# EAGLE design amiga_ps2_adapter (EAGLE 9.6.1)
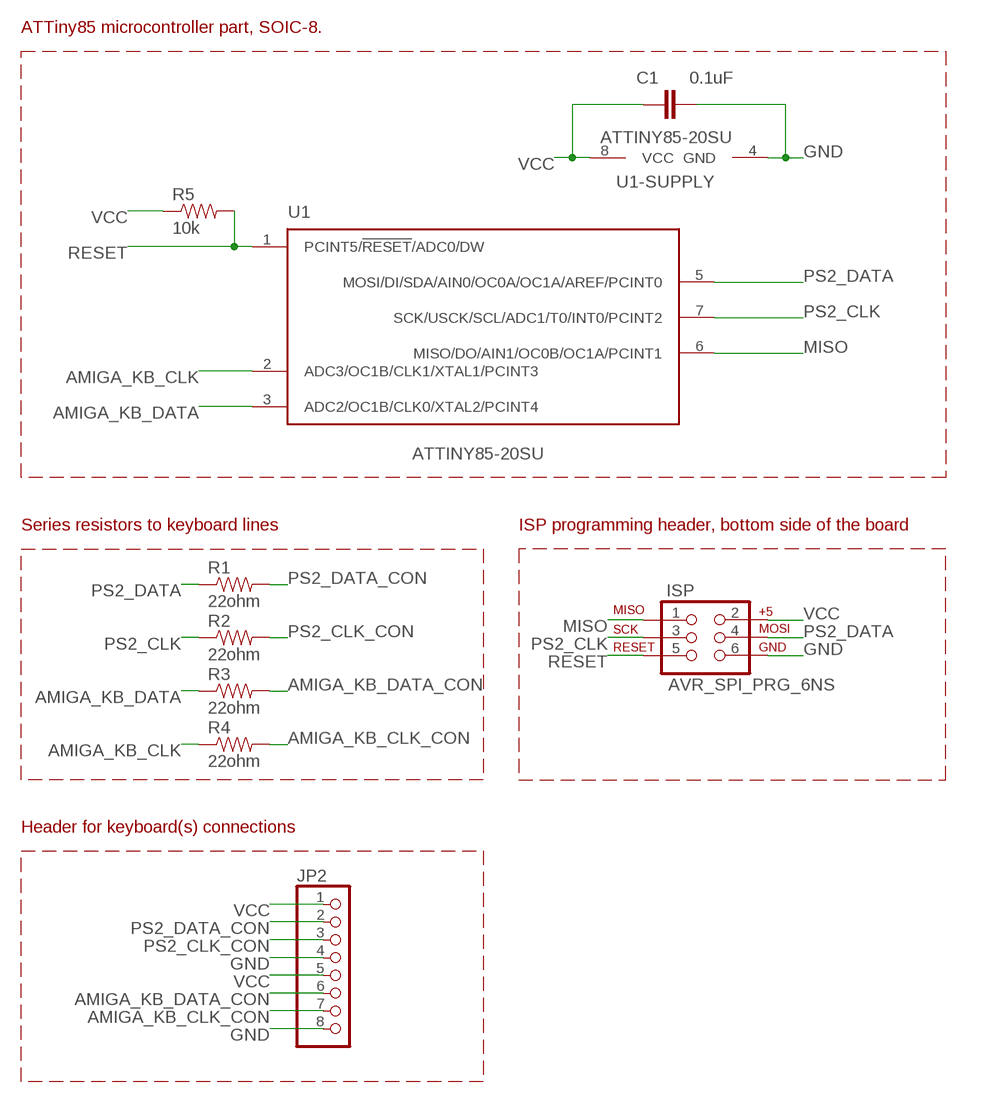
[diagram p0: schematic, sheet 1]

## Parts
C1  0.1uF  CAP0603-CAP  [0603-CAP]
ISP  AVR_SPI_PRG_6NS  [2X3-NS]
JP2  HEADER-1X8ROUND  [1X08_ROUND]
R1  22ohm  RESISTOR0603-RES  [0603-RES]
R2  22ohm  RESISTOR0603-RES  [0603-RES]
R3  22ohm  RESISTOR0603-RES  [0603-RES]
R4  22ohm  RESISTOR0603-RES  [0603-RES]
R5  10k  RESISTOR0603-RES  [0603-RES]
U1  ATTINY85-20SU  [SOIC-8]

## Nets
AMIGA_KB_CLK: R4.1 U1.2(ADC3/OC1B/CLK1/XTAL1/PCINT3)
AMIGA_KB_CLK_CON: JP2.7 R4.2
AMIGA_KB_DATA: R3.1 U1.3(ADC2/OC1B/CLK0/XTAL2/PCINT4)
AMIGA_KB_DATA_CON: JP2.6 R3.2
GND: C1.2 ISP.6 JP2.4 JP2.8 U1.4(GND)
MISO: ISP.1 U1.6(MISO/DO/AIN1/OC0B/OC1A/PCINT1)
PS2_CLK: ISP.3 R2.1 U1.7(SCK/USCK/SCL/ADC1/T0/INT0/PCINT2)
PS2_CLK_CON: JP2.3 R2.2
PS2_DATA: ISP.4 R1.1 U1.5(MOSI/DI/SDA/AIN0/OC0A/OC1A/AREF/PCINT0)
PS2_DATA_CON: JP2.2 R1.2
RESET: ISP.5 R5.2 U1.1(PCINT5/!RESET!/ADC0/DW)
VCC: C1.1 ISP.2 JP2.1 JP2.5 R5.1 U1.8(VCC)

## Notes on the sheet
- ATTiny85 microcontroller part, SOIC-8.
- Series resistors to keyboard lines | ISP programming header, bottom side of the board
- Header for keyboard(s) connections

## Library data of the parts
C1 = SparkFun-Capacitors:CAP: Capacitor Standard 0603 ceramic capacitor, and 0.1" leaded capacitor.
ISP = SparkFun-Connectors:AVR_SPI_PRG_6: AVR ISP 6 Pin This is the reduced ISP connector for AVR programming. Common on Arduino. This footprint will take up less PCB space and can be used with a 10-pin to 6-pin adapter such as SKU: BOB-08508 **Special note about "TEST_POINT" package. The stop mask is on the top side, so if you want your programming test points to be on the bottom of your board, make sure to place this package on the bottom side of the board. This also ensure that the orientation to program from the bottom side will be correct.
JP2 = microbuilder:HEADER-1X8: PIN HEADER
R1-R5 = SparkFun-Passives:RESISTOR: Resistor Basic schematic elements and footprints for 0603, 1206, and PTH resistors.
U1 = volks73-Atmel:ATTINY*5-?: AVR® ATtiny2/4/85 Microcontroller Atmel 8-bit AVR Microcontroller with 2/4/8K Bytes In-System Programmable Flash Documentation Datasheet <http://www.atmel.com/images/atmel-2586-avr-8-bit-microcontroller-attiny25-attiny45-attiny85_datasheet.pdf> Features High Performance, Low Power AVR® 8-Bit Microcontroller Advanced RISC Architecture 120 Powerful Instructions – Most Single Clock Cycle Execution 32 x 8 General Purpose Working Registers Fully Static Operation Non-volatile Program and Data Memories 2/4/8K Bytes of In-System Programmable Program Memory Flash Endurance: 10,000 Write/Erase Cycles 128/256/512 Bytes In-System Programmable EEPROM Endurance: 100,000 Write/Erase Cycles 128/256/512 Bytes Internal SRAM Programming Lock for Self-Programming Flash Program and EEPROM Data Security Peripheral Features 8-bit Timer/Counter with Prescaler and Two PWM Channels 8-bit High Speed Timer/Counter with Separate Prescaler 2 High Frequency PWM Outputs with Separate Output Compare Registers Programmable Dead Time Generator USI – Universal Serial Interface with Start Condition Detector 10-bit ADC 4 Single Ended Channels 2 Differential ADC Channel Pairs with Programmable Gain (1x, 20x) Temperature Measurement Programmable Watchdog Timer with Separate On-chip Oscillator On-chip Analog Comparator Special Microcontroller Features debugWIRE On-chip Debug System In-System Programmable via SPI Port External and Internal Interrupt Sources Low Power Idle, ADC Noise Reduction, and Power-down Modes Enhanced Power-on Reset Circuit Programmable Brown-out Detection Circuit Internal Calibrated Oscillator I/O and Packages Six Programmable I/O Lines 8-pin PDIP, 8-pin SOIC, 20-pad QFN/MLF, and 8-pin TSSOP (only ATtiny45/V) Operating Voltage 1.8 - 5.5V for ATtiny25V/45V/85V 2.7 - 5.5V for ATtiny25/45/85 Speed Grade ATtiny25V/45V/85V: 0 – 4 MHz @ 1.8 - 5.5V, 0 - 10 MHz @ 2.7 - 5.5V ATtiny25/45/85: 0 – 10 MHz @ 2.7 - 5.5V, 0 - 20 MHz @ 4.5 - 5.5V Industrial Temperature Range Low Power Consumption Active Mode: 1 MHz, 1.8V: 300 μA Power-down Mode: 0.1 μA at 1.8V; CATEGORY: Integrated Circuits (ICs); CONNECTIVITY: USI; CORE_PROCESSOR: AVR; CORE_SIZE: 8-Bit; DATA_CONVERTERS: A/D 4x10b; DESCRIPTION: IC MCU 8BIT 8KB FLASH 8SOIC; DOCUMENTATION_LINK: <a href="http://www.atmel.com/Images/Atmel-2586-AVR-8-bit-Microcontroller-ATtiny25-ATtiny45-ATtiny85_Datasheet.pdf">Datasheet</a>; DOCUMENTATION_URL: http://www.atmel.com/Images/Atmel-2586-AVR-8-bit-Microcontroller-ATtiny25-ATtiny45-ATtiny85_Datasheet.pdf; EEPROM_SIZE: 512 x 8; FAMILY: Embedded - Microcontrollers; MANUFACTURER: Atmel; NUMBER_OF_IO: 6; OPERATING_TEMPERATURE: -40°C ~ 85°C; OSCILLATOR_TYPE: Internal; PACKAGE: 8-SOIC (0.209", 5.30mm Width); PART_NUMBER: ATTINY85-20SU; PERIPHERALS: Brown-out Detect/Reset, POR, PWM, WDT; PROGRAM_MEMORY_SIZE: 8KB (4K x 16); PROGRAM_MEMORY_TYPE: FLASH; RAM_SIZE: 512 x 8; SERIES: AVR® ATtiny; SPEED: 20MHz; SUPPLIER_DEVICE_PACKAGE: 8-SOIC; SUPPLIER_ITEM_LINK: <a href="http://www.digikey.com/product-detail/en/ATTINY85-20SU/ATTINY85-20SU-ND/735470">Details</a>; SUPPLIER_ITEM_NUMBER: ATTINY85-20SU-ND; SUPPLIER_ITEM_URL: http://www.digikey.com/product-detail/en/ATTINY85-20SU/ATTINY85-20SU-ND/735470; SUPPLIER_LINK: <a href="http://www.digikey.com">Home Page</a>; SUPPLIER_NAME: Digi-Key; SUPPLIER_URL: http://www.digikey.com; VOLTAGE-SUPPLY: 2.7 V ~ 5.5 V

## Board
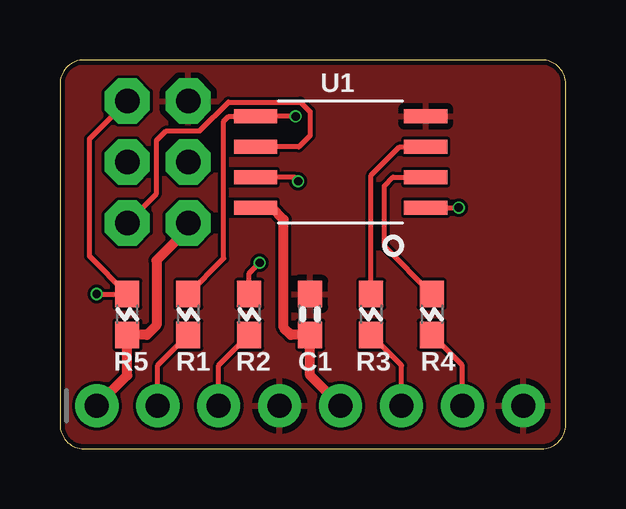
[diagram p1: board, top side]
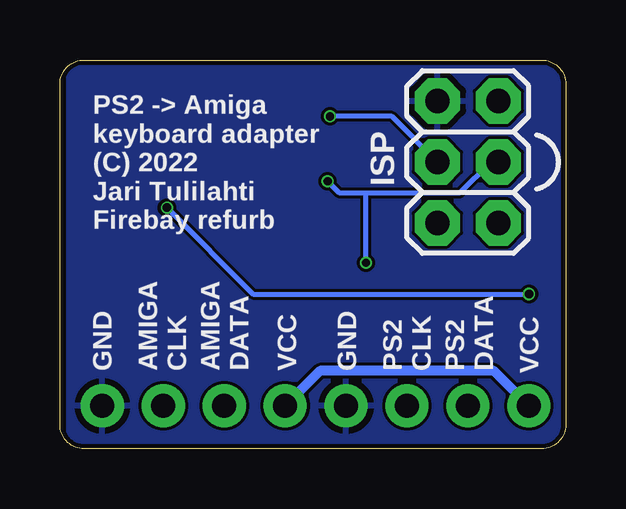
[diagram p2: board, bottom side, seen from below]

Size 21.09 x 16.2 mm. Coordinates in mm from the lower left corner, seen from the top.
Outline: 0,15.2 0,1 arc90 1,0 20.09,0 arc90 21.09,1 21.09,15.2 arc90 20.09,16.2 1,16.2 arc90 0,15.2
Copper layers (1*16): Top 0.035mm / dielectric 1.6mm / Bottom 0.035mm
Design rules "jlcpcb-2layers": minimum track width 5mil, minimum drill 0.3mm, track to track 5mil, track to pad 5mil, pad to pad 5mil, via to via 5mil, smd to smd 5mil, copper to edge 0.2mm, drill to drill 6mil, minimum pad ring 10mil, minimum via ring 3mil, stop-mask expansion 4mil, vias tented up to drill 0mil, thermal gap 10mil

### Footprints (pad centres in the part's own frame; a part is rotated, then mirrored left to right if it is on the bottom)
0603-CAP = smd 1.1 x 1: 1 -0.85,0; 2 0.85,0
2X3-NS = drill 1.016 pad 1.88 octagon: 1 -2.54,-1.27; 2 -2.54,1.27; 3 0,-1.27; 4 0,1.27; 5 2.54,-1.27; 6 2.54,1.27
1X08_ROUND = drill 1 pad 1.676: 1 -8.89,0; 2 -6.35,0; 3 -3.81,0; 4 -1.27,0; 5 1.27,0; 6 3.81,0; 7 6.35,0; 8 8.89,0
0603-RES = smd 1.1 x 1: 1 -0.85,0; 2 0.85,0
SOIC-8 = smd 1.8 x 0.6: 1 -3.55,1.905; 2 -3.55,0.635; 3 -3.55,-0.635; 4 -3.55,-1.905; 5 3.55,-1.905; 6 3.55,-0.635; 7 3.55,0.635; 8 3.55,1.905

### Placement (x,y rotation side)
C1  10.43,5.6 90 top
ISP  4.08,11.95 90 bottom
JP2  10.43,1.79 0 top
R1  5.35,5.6 270 top
R2  7.89,5.6 270 top
R3  12.97,5.6 270 top
R4  15.51,5.6 270 top
R5  2.81,5.6 90 top
U1  11.7,11.95 180 top

### Tracks (layer width: path | path; a pad name or v marks a point on that pad's centre or on a via)
AMIGA_KB_CLK
  Top 0.203: R4.1 13.53,8.43 13.53,10.95 13.89,11.31 U1.2
AMIGA_KB_CLK_CON
  Top 0.203: JP2.7 16.78,3.48 R4.2
AMIGA_KB_DATA
  Top 0.203: R3.1 12.97,11.39 14.16,12.59 U1.3
AMIGA_KB_DATA_CON
  Top 0.203: JP2.6 14.24,3.48 R3.2
GND
  pour Top: -0.27,16.25 20.73,16.25 20.73,-0.25 -0.27,-0.25
  pour Bottom: -0.27,16.25 20.73,16.25 20.73,-0.25 -0.27,-0.25
MISO
  Top 0.203: ISP.1 4.03,10.63 4.03,12.85 4.43,13.25 5.83,13.25 7.03,14.45 10.03,14.45 10.43,14.05 10.43,13.05 9.96,12.59 U1.6
PS2_CLK  (via drill 0.35)
  Top 0.203: U1.7 9.77,11.31 v9.93,11.15 | R2.1 7.89,7.31 v8.33,7.75
  Bottom 0.203: ISP.3 3.13,11.95 4.43,10.65 8.33,10.65 | v9.93,11.15 9.43,10.65 8.33,10.65 | v8.33,7.75 8.33,10.65
PS2_CLK_CON
  Top 0.203: JP2.3 6.62,3.48 R2.2
PS2_DATA  (via drill 0.35)
  Top 0.203: R1.1 6.83,7.93 6.83,13.65 7.04,13.86 U1.5 v9.83,13.85
  Bottom 0.203: ISP.4 7.25,13.85 v9.83,13.85
PS2_DATA_CON
  Top 0.203: JP2.2 4.08,3.48 R1.2
RESET  (via drill 0.35)
  Top 0.203: ISP.5 1.23,12.91 1.23,8.03 R5.2 v1.53,6.45 | U1.1 v16.62,10.04 v16.63,10.05
  Bottom 0.203: v16.63,10.05 13.03,6.45 v1.53,6.45
VCC
  Top 0.406: JP2.5 10.43,3.06 C1.1 9.63,4.75 9.33,5.05 9.33,9.55 8.84,10.04 U1.8 | JP2.1 2.81,3.06 R5.1 3.63,4.75 4.03,5.15 4.03,7.85 5.35,9.17 ISP.2
  Bottom 0.406: JP2.1 3,3.25 10.24,3.25 JP2.5

### Text on the board
bNames: PS2 -> Amiga / keyboard adapter / (C) 2022 / Jari Tulilahti / Firebay refurb | VCC | PS2 / DATA | PS2 / CLK | GND | VCC | AMIGA / DATA | AMIGA / CLK | GND